# Altium schematic sheet Transmitter.SchDoc
size A; SheetNumber: 1; SheetTotal: 2
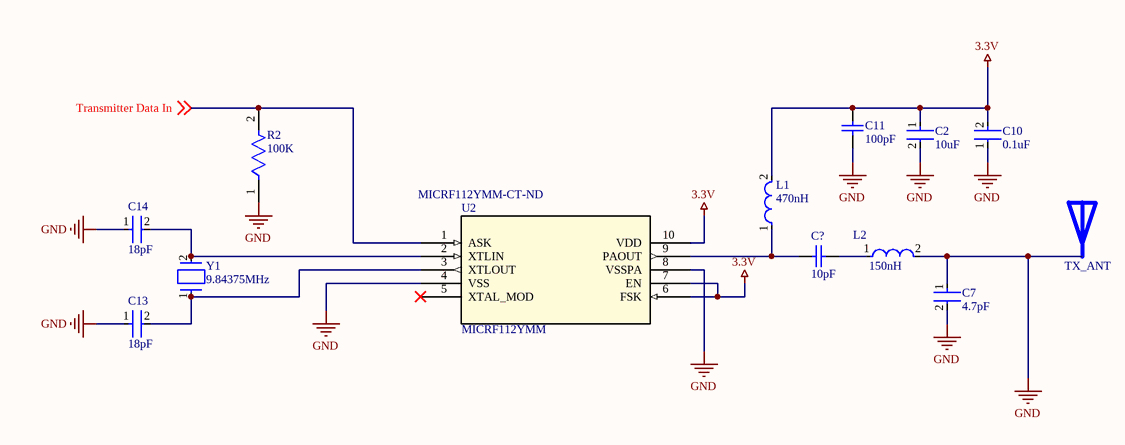
[diagram p0: Transmitter.SchDoc]

## Parts
C2  10uF  [FP-GRM188-0_1-e0_2_0_55-IPC_A]
C7  4.7pF  [FP-C0402-BB-MFG]
C10  0.1uF  [FP-GRM15-MFG]
C11  100pF  [CAPC1608X90X35NL10T15]
C13  18pF  [FP-C0805C-DN-MFG]
C14  18pF  [FP-C0805C-DN-MFG]
C?  10pF  [CAPC1608X90X35LL10T15]
L1  470nH  [FP-LQW2UAS_00-MFG]
L2  150nH  [FP-LQW2BHN_03-MFG]
R2  100K  [FP-ERJ2RK-IPC_C]
TX_ANT  TX Antenna  [TX Antenna]  (value not drawn)
U2  MICRF112YMM  Supplier Part Number 1: MICRF112YMM-CT-ND  [MSOP10_MC_MCH]
Y1  9.84375MHz  [FP-ABM7-MFG]

## Nets
3.3V: C2.1 C10.2 C11.2 L1.2 U2.6(FSK) U2.7(EN) U2.10(VDD)
GND: C2.2 C7.1 C7.2 C10.1 C11.1 C13.1 C14.1 L2.2 R2.1 U2.4(VSS) U2.8(VSSPA)
Transmitter Data In: R2.2 U2.1(ASK) ; off-sheet Transmitter Data In
NetC13_2: C13.2 U2.3(XTLOUT) Y1.1
NetC14_2: C14.2 U2.2(XTLIN) Y1.2
NetC?_1: C?.1 L1.1 U2.9(PAOUT)
NetC?_2: C?.2 L2.1

Not connected (* = marked no-connect by the designer): U2 5(XTAL_MOD)*

## Library data of the parts
C2 = CMP-2006-02792-2: Chip Multilayer Ceramic Capacitors for General Purpose, 0603, 10uF, X5R, 15%, 20%, 6.3V; Packaging: Tape and Reel; Voltage Rating (DC): 6.3V; Width: 0.031inch; Termination: SMD/SMT; Dielectric: X5R; Package Quantity: 4000; Voltage Rating: 6.3V; Capacitance: 10uF; Case/Package: 0603; Min Operating Temperature: -55°C; Voltage: 6.3V; Length: 1.6mm; Thickness: 0.035inch; Lead Free: Lead Free; Depth: 0.8mm; Case Code (Imperial): 0603; Max Operating Temperature: 85°C; Material: Ceramic; Height: 0.8mm; Tolerance: 20%; Mount: Surface Mount; REACH SVHC: No SVHC; Radiation Hardening: No; Case Code (Metric): 1608
C7 = CMP-2008-03310-2: CAP CER 4.7PF 50V NP0 0402; Manufacturer Part Number: C0402C479C5GACTU; Manufacturer: Kemet; Material: Ceramic; Tolerance: 0.25 pF; Temperature Coefficient: 15%; Temperature Characteristic: C0G; Lead Free: Yes; Device Class L1: Passive Components; ComponentLink2Description: Datasheet; Temperature: -55°C to +125°C; Digikey Description: CAP CER 4.7PF 50V NP0 0402; Ipc Land Pattern Name: CAPC10050X50; ComponentLink2URL: https://content.kemet.com/datasheets/KEM_C1002_X7R_SMD.pdf; Octopart: https://octopart.com/c0402c479c5gactu-kemet-9144199; Mouser Description: Multilayer Ceramic Capacitors MLCC - SMD/SMT 50volts 4.7pF C0G .25pF; Automotive: No; Voltage Rating: 50 V; Device Class L3: Ceramic Capacitors; Capacitance: 4.7 pF; Category: Cap; Value: 4.7 pF; Package: C0402-BB; Height: 0.55mm; Temperature Range Low: -55°C; RoHS: TRUE; Device Class L2: Capacitors; Temperature Range High: +125°C
C10 = CMP-2100-03641-2: CAP CER 0.1UF 16V X7R 0402; Manufacturer Part Number: GRM155R71C104KA88D; Manufacturer: Murata; Standoff Height: 0mm; Tolerance: 10%; Voltage Rating: 16Vdc; Material: Ceramic; Capacitance: 0.10μF; Value: 0.10μF; RoHS: TRUE; Temperature Characteristic: X7R; Octopart: https://octopart.com/grm155r71c104ka88d-murata-196880; Digikey Description: CAP CER 0.1UF 16V X7R 0402; Device Class L3: Ceramic Capacitors; Height: 0.55mm; ComponentLink2Description: Datasheet; Temperature Range Low: -55°C; Ipc Land Pattern Name: CAPC10050X219; ComponentLink2URL: https://search.murata.co.jp/Ceramy/image/img/A01X/G101/ENG/GRM155R71H471KA01-01A.pdf; Device Class L1: Passive Components; Lead Free: yes; Category: Cap; Package: GRM15; Temperature: -55°C to +125°C; Device Class L2: Capacitors; Temperature Range High: +125°C; Mouser Description: 0402 0.1 uF 16V ±10 % Tolerance X7R SMT Multilayer Ceramic Capacitor
C11 = CMP-2006-02595-1: Part Number: GRM1885C1H101JA01D; Manufacturer: Murata
C13 C14 = CMP-2007-00302-2: CAP CER 18PF 50V C0G/NP0 0805; Manufacturer: KEMET; Manufacturer Part Number: C0805C180J5GACTU; Temperature Characteristic: C0G; Tolerance: 0.05; Material: Ceramic; Temperature Coefficient: 30ppm/°C; Device Class L2: Capacitors; Capacitance: 18 pF; Temperature: -55°C to +125°C; Value: 18 pF; Package: C0805C-DN; Mouser Description: Cap Ceramic 18pF 50V C0G 5% SMD 0805 125C Paper T/R; Height: 0.88mm; ComponentLink2URL: https://content.kemet.com/datasheets/KEM_C1003_C0G_SMD.pdf; RoHS: TRUE; Octopart: https://octopart.com/c0805c180j5gactu-kemet-144810; ComponentLink2Description: Datasheet; Temperature Range High: +125°C; Digikey Description: CAP CER 18PF 50V C0G/NP0 0805; Device Class L1: Passive Components; Category: Cap; Automotive: No; Device Class L3: Ceramic Capacitors; Voltage Rating: 50 V; Temperature Range Low: -55°C; Ipc Land Pattern Name: CAPC200125X78; Lead Free: Yes
C? = CMP-2006-02592-1: Part Number: GRM1885C1H100JA01D; Manufacturer: Murata
L1 = CMP-06042-015512-1: Wire Wound RF Inductor 470nH ±5% 470mA 1.19Ω 1008 (2520); Test Frequency: 25MHz; DC Resistance (DCR): 1.19R; Core Material: Air; Shielding: Unshielded; Self Resonant Frequency: 450MHz; Q Factor: 45; Case Code (Metric): 2520; Packaging: Tape and Reel; Inductance: 470nH; Tolerance: 5%; Width: 0.096inch; Radiation Hardening: No; Case Code (Imperial): 1008; Resistor Type: Wirewound; Depth: 2.65mm; Min Operating Temperature: -55°C; Inductance Tolerance: 5%; Max DC Current: 470mA; Mount: Surface Mount; Series: LQW2UA; Max Operating Temperature: 125°C; REACH SVHC: No SVHC; Termination: SMD/SMT; Current Rating: 470mA; Height - Seated (Max): 0.08inch; Package Quantity: 2000; Height: 1.83mm; Lead Free: Lead Free; Length: 0.103inch; Weight: 0.001376oz; Case/Package: 1008
L2 = CMP-06042-003065-1: Wire Wound RF Inductor 150nH ±5% 390mA 0.47Ω 0805 (2015); Q Factor: 30; Shielding: Unshielded; Core Material: Non-Magnetic; Test Frequency: 100MHz; Series Resistance: 470mR; Self Resonant Frequency: 350MHz; DC Current: 390mA; Tolerance: 5%; Max DC Current: 390mA; Radiation Hardening: No; Packaging: Tape and Reel; Case/Package: 0805; Package Quantity: 2000; Length: 2mm; Case Code (Imperial): 0805; Weight: 0.000317oz; Resistor Type: Wirewound; Height - Seated (Max): 0.07inch; Depth: 1.7mm; Min Operating Temperature: -40°C; Height: 1.7mm; Lead Free: Lead Free; Current Rating: 390mA; Case Code (Metric): 2012; Military Standard: Not; Inductance: 150nH; Mount: Surface Mount; Width: 0.059inch; DC Resistance (DCR): 470mR; Termination: SMD/SMT; Max Operating Temperature: 85°C
R2 = CMP-2002-00608-4: RES SMD 100K OHM 1% 1/10W 0402; Resistance: 100kR; Voltage Rating (DC): 50V; Power Rating: 100mW; Temperature Coefficient: 100ppm/°C; Case/Package: 0402; Length: 1mm; Package Quantity: 1; Radiation Hardening: No; Case Code (Metric): 1005; Contact Plating: Tin; Mount: Surface Mount; Depth: 0.5mm; Max Operating Temperature: 155°C; Lead Free: Lead Free; Width: 0.5mm; Composition: Thick Film; Case Code (Imperial): 0402; Tolerance: 1%; Termination: SMD/SMT; Number of Pins: 2; Height: 0.35mm; Voltage Rating: 50V; Military Standard: Not; REACH SVHC: No SVHC; Packaging: Tape and Reel; Min Operating Temperature: -55°C; Max Power Dissipation: 100mW; Features: Automotive AEC-Q200; Number of Terminations: 2
U2 = MICRF112YMM: No Description Available; Mfr_Name: Microchip; Copyright: Copyright (C) 2022 Ultra Librarian. All rights reserved.; Manufacturer_Part_Number: MICRF112YMM; RefDes: RefDes; Type: DEV; Supplier 1: Digi-Key
Y1 = CMP-27762-013556-1: Crystal 9.84375MHz ±30ppm 10pF SMD-2 6mm x 3.5mm; Frequency Stability: 100ppm; ESR (Equivalent Series Resistance): 50R; Width: 0.138inch; Mount: Surface Mount; Height: 0.055inch; Case/Package: SMD/SMT; Frequency Tolerance: 30ppm; Max Operating Temperature: 85°C; Length: 0.236inch; Min Operating Temperature: -40°C; Packaging: Tape and Reel; Frequency: 9.84375MHz; Load Capacitance: 10pF